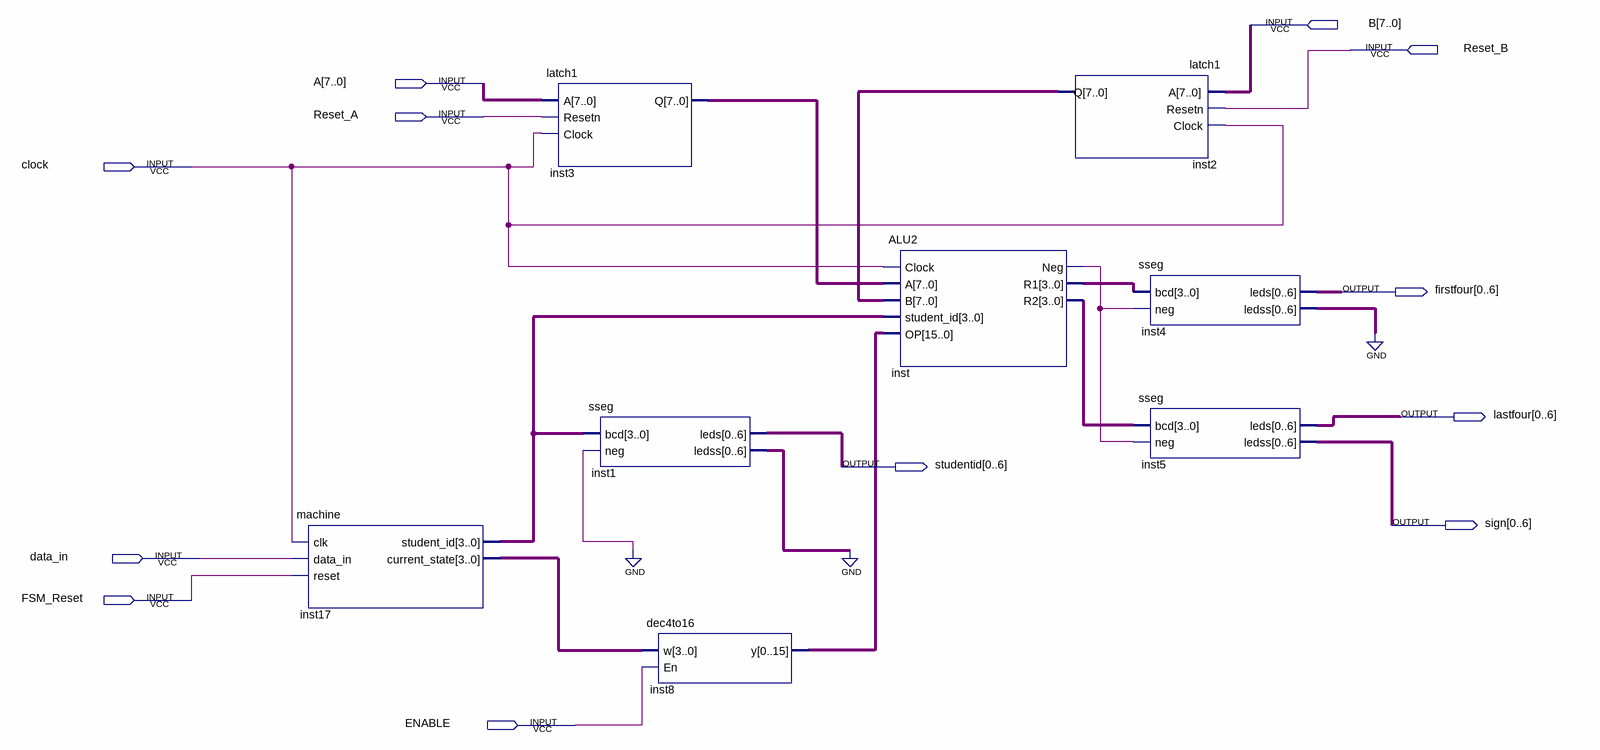
[diagram p0: schematic sheet]
// Quartus schematic block2.bdf as structural Verilog: 8 symbols, 12 pins
module block2 (
  input  [7:0] B,
  input  Reset_B,
  input  [7:0] A,
  input  Reset_A,
  input  clock,
  input  data_in,
  input  FSM_Reset,
  input  ENABLE,
  output [0:6] firstfour,
  output [0:6] lastfour,
  output [0:6] studentid,
  output [0:6] sign
);

  wire inst_neg;
  wire [3:0] inst17_current_state, inst17_student_id, inst_r1, inst_r2;
  wire [6:0] inst1_ledss, inst4_ledss;
  wire [7:0] inst2_q, inst3_q;
  wire [15:0] inst8_y;

  machine inst17 (
    .clk(clock), .data_in(data_in), .reset(FSM_Reset), .student_id(inst17_student_id),
    .current_state(inst17_current_state));
  latch1 inst3 (.A(A), .Resetn(Reset_A), .Clock(clock), .Q(inst3_q));
  sseg inst1 (.bcd(inst17_student_id), .neg(1'b0), .leds(studentid), .ledss(inst1_ledss));
  dec4to16 inst8 (.w(inst17_current_state), .En(ENABLE), .y(inst8_y));
  ALU2 inst (
    .Clock(clock), .A(inst3_q), .B(inst2_q), .student_id(inst17_student_id), .OP(inst8_y), .Neg(inst_neg),
    .R1(inst_r1), .R2(inst_r2));
  latch1 inst2 (.A(B), .Resetn(Reset_B), .Clock(clock), .Q(inst2_q));
  sseg inst4 (.bcd(inst_r1), .neg(inst_neg), .leds(firstfour), .ledss(inst4_ledss));
  sseg inst5 (.bcd(inst_r2), .neg(inst_neg), .leds(lastfour), .ledss(sign));
  // also tied to GND on the sheet: {inst4_ledss[0], inst4_ledss[1], inst4_ledss[2], inst4_ledss[3], inst4_ledss[4], inst4_ledss[5], inst4_ledss[6], inst1_ledss[0], inst1_ledss[1], inst1_ledss[2], inst1_ledss[3], inst1_ledss[4], inst1_ledss[5], inst1_ledss[6]}
endmodule
